# EAGLE design Kill Switch (EAGLE 5.02)
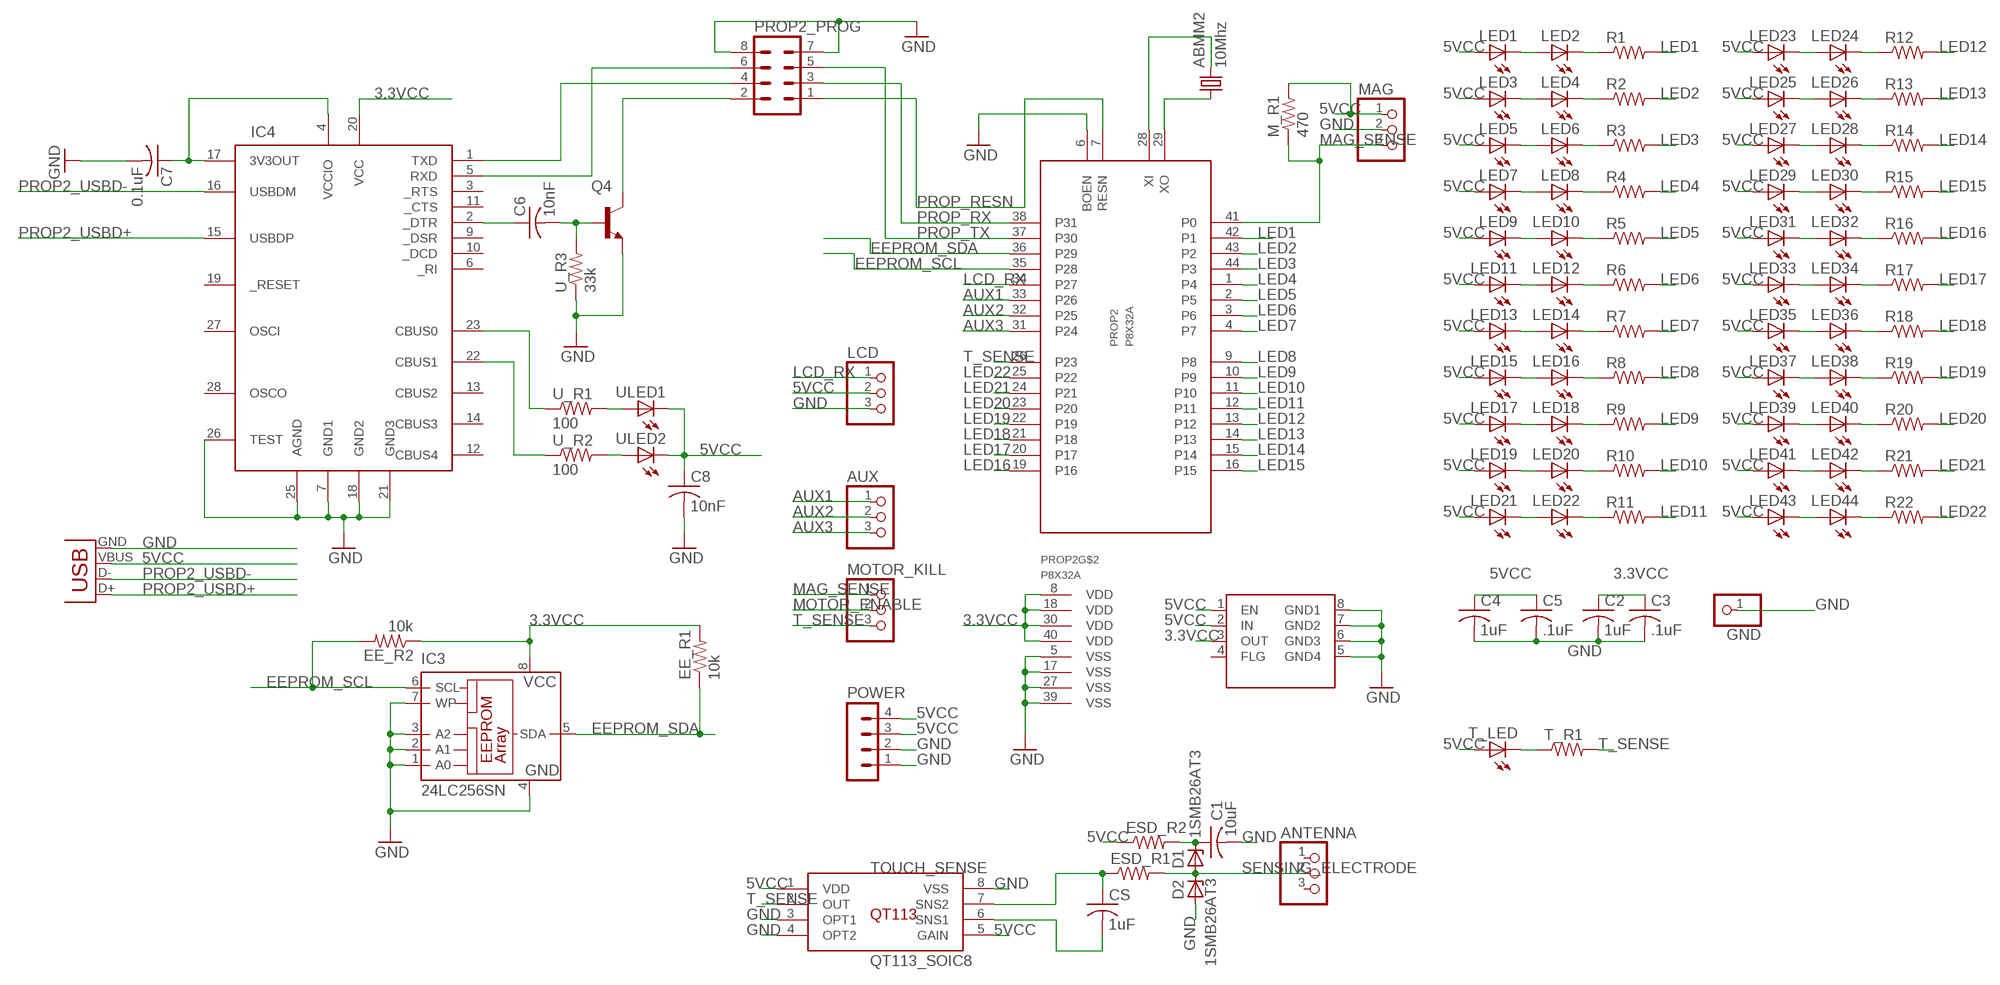
[diagram p0: schematic, sheet 1]

## Parts
3.3_VREG  TEST  [SOIC-8]
ABMM2  10Mhz  ABMM2  [ABMM2]
ANTENNA  PINHD-1X3  [1X03]
AUX  PINHD-1X3  [1X03]
C1  10uF  C-USC0402K  [C0402K]
C2  1uF  C-USC0402  [C0402]
C3  .1uF  C-USC0402  [C0402]
C4  1uF  C-USC0402  [C0402]
C5  .1uF  C-USC0402  [C0402]
C6  10nF  C-USC0402  [C0402]
C7  0.1uF  C-USC0402  [C0402]
C8  10nF  C-USC0402  [C0402]
CS  1uF  C-USC0402K  [C0402K]
D1  1SMB26AT3  TVS-SMB  [SMB@2]
D2  1SMB26AT3  TVS-SMB  [SMB@2]
EE_R1  10k  R-US_R0402  [R0402]
EE_R2  10k  R-US_R0402  [R0402]
ESD_R1  R-US_R0402  [R0402]
ESD_R2  R-US_R0402  [R0402]
GND  PINHD-1X1  [1X01]
IC3  24LC256SN  [SO-08]
IC4  FT232RL  [SSOP28DB]
LCD  PINHD-1X3  [1X03]
LED1  LEDCHIPLED_0805  [CHIPLED_0805]
LED2  LEDCHIPLED_0805  [CHIPLED_0805]
LED3  LEDCHIPLED_0805  [CHIPLED_0805]
LED4  LEDCHIPLED_0805  [CHIPLED_0805]
LED5  LEDCHIPLED_0805  [CHIPLED_0805]
LED6  LEDCHIPLED_0805  [CHIPLED_0805]
LED7  LEDCHIPLED_0805  [CHIPLED_0805]
LED8  LEDCHIPLED_0805  [CHIPLED_0805]
LED9  LEDCHIPLED_0805  [CHIPLED_0805]
LED10  LEDCHIPLED_0805  [CHIPLED_0805]
LED11  LEDCHIPLED_0805  [CHIPLED_0805]
LED12  LEDCHIPLED_0805  [CHIPLED_0805]
LED13  LEDCHIPLED_0805  [CHIPLED_0805]
LED14  LEDCHIPLED_0805  [CHIPLED_0805]
LED15  LEDCHIPLED_0805  [CHIPLED_0805]
LED16  LEDCHIPLED_0805  [CHIPLED_0805]
LED17  LEDCHIPLED_0805  [CHIPLED_0805]
LED18  LEDCHIPLED_0805  [CHIPLED_0805]
LED19  LEDCHIPLED_0805  [CHIPLED_0805]
LED20  LEDCHIPLED_0805  [CHIPLED_0805]
LED21  LEDCHIPLED_0805  [CHIPLED_0805]
LED22  LEDCHIPLED_0805  [CHIPLED_0805]
LED23  LEDCHIPLED_0805  [CHIPLED_0805]
LED24  LEDCHIPLED_0805  [CHIPLED_0805]
LED25  LEDCHIPLED_0805  [CHIPLED_0805]
LED26  LEDCHIPLED_0805  [CHIPLED_0805]
LED27  LEDCHIPLED_0805  [CHIPLED_0805]
LED28  LEDCHIPLED_0805  [CHIPLED_0805]
LED29  LEDCHIPLED_0805  [CHIPLED_0805]
LED30  LEDCHIPLED_0805  [CHIPLED_0805]
LED31  LEDCHIPLED_0805  [CHIPLED_0805]
LED32  LEDCHIPLED_0805  [CHIPLED_0805]
LED33  LEDCHIPLED_0805  [CHIPLED_0805]
LED34  LEDCHIPLED_0805  [CHIPLED_0805]
LED35  LEDCHIPLED_0805  [CHIPLED_0805]
LED36  LEDCHIPLED_0805  [CHIPLED_0805]
LED37  LEDCHIPLED_0805  [CHIPLED_0805]
LED38  LEDCHIPLED_0805  [CHIPLED_0805]
LED39  LEDCHIPLED_0805  [CHIPLED_0805]
LED40  LEDCHIPLED_0805  [CHIPLED_0805]
LED41  LEDCHIPLED_0805  [CHIPLED_0805]
LED42  LEDCHIPLED_0805  [CHIPLED_0805]
LED43  LEDCHIPLED_0805  [CHIPLED_0805]
LED44  LEDCHIPLED_0805  [CHIPLED_0805]
M_R1  470  R-US_R0402  [R0402]
MAG  PINHD-1X3  [1X03]
MOTOR_KILL  PINHD-1X3  [1X03]
POWER  MA04-1  [MA04-1]
PROP2  P8X32A  [LQFP-44]
PROP2_PROG  MA04-2  [MA04-2]
Q4  TRANSISTOR_NPNSOT23  [SOT23]
R1  R-US_R0402  [R0402]
R2  R-US_R0402  [R0402]
R3  R-US_R0402  [R0402]
R4  R-US_R0402  [R0402]
R5  R-US_R0402  [R0402]
R6  R-US_R0402  [R0402]
R7  R-US_R0402  [R0402]
R8  R-US_R0402  [R0402]
R9  R-US_R0402  [R0402]
R10  R-US_R0402  [R0402]
R11  R-US_R0402  [R0402]
R12  R-US_R0402  [R0402]
R13  R-US_R0402  [R0402]
R14  R-US_R0402  [R0402]
R15  R-US_R0402  [R0402]
R16  R-US_R0402  [R0402]
R17  R-US_R0402  [R0402]
R18  R-US_R0402  [R0402]
R19  R-US_R0402  [R0402]
R20  R-US_R0402  [R0402]
R21  R-US_R0402  [R0402]
R22  R-US_R0402  [R0402]
T_LED  LEDCHIPLED_0805  [CHIPLED_0805]
T_R1  R-US_R0402  [R0402]
TOUCH_SENSE  QT113_SOIC8  [SOIC8]
U_R1  100  R-US_R0402  [R0402]
U_R2  100  R-US_R0402  [R0402]
U_R3  33k  R-US_R0402  [R0402]
ULED1  LEDCHIPLED_0805  [CHIPLED_0805]
ULED2  LEDCHIPLED_0805  [CHIPLED_0805]
X2  USBMINIB  [USB-MINIB]

## Nets
3.3VCC: 3.3_VREG.3(OUT) C2.1 C3.1 EE_R1.2 EE_R2.1 IC3.8(VCC) IC4.20(VCC) PROP2.8(VDD) PROP2.18(VDD) PROP2.30(VDD) PROP2.40(VDD)
5VCC: 3.3_VREG.1(EN) 3.3_VREG.2(IN) C4.1 C5.1 C8.1 ESD_R2.1 LCD.2 LED1.A LED3.A LED5.A LED7.A LED9.A LED11.A LED13.A LED15.A LED17.A LED19.A LED21.A LED23.A LED25.A LED27.A LED29.A LED31.A LED33.A LED35.A LED37.A LED39.A LED41.A LED43.A M_R1.2 MAG.1 POWER.3 POWER.4 T_LED.A TOUCH_SENSE.1(VDD) TOUCH_SENSE.5(GAIN) ULED1.C ULED2.C X2.VBUS
AUX1: AUX.1 PROP2.33(P26)
AUX2: AUX.2 PROP2.32(P25)
AUX3: AUX.3 PROP2.31(P24)
EEPROM_SCL: EE_R2.2 IC3.6(SCL) PROP2.35(P28)
EEPROM_SDA: EE_R1.1 IC3.5(SDA) PROP2.36(P29)
GND: 3.3_VREG.5(GND4) 3.3_VREG.6(GND3) 3.3_VREG.7(GND2) 3.3_VREG.8(GND1) C1.2 C2.2 C3.2 C4.2 C5.2 C7.2 C8.2 D2.A GND.1 IC3.1(A0) IC3.2(A1) IC3.3(A2) IC3.4(GND) IC3.7(WP) IC4.7(GND1) IC4.18(GND2) IC4.21(GND3) IC4.25(AGND) IC4.26(TEST) LCD.3 MAG.2 POWER.1 POWER.2 PROP2.5(VSS) PROP2.6(BOEN) PROP2.17(VSS) PROP2.27(VSS) PROP2.39(VSS) PROP2_PROG.7 PROP2_PROG.8 Q4.2(E) TOUCH_SENSE.3(OPT1) TOUCH_SENSE.4(OPT2) TOUCH_SENSE.8(VSS) U_R3.1 X2.GND
LCD_RX: LCD.1 PROP2.34(P27)
LED1: PROP2.42(P1) R1.2
LED2: PROP2.43(P2) R2.2
LED3: PROP2.44(P3) R3.2
LED4: PROP2.1(P4) R4.2
LED5: PROP2.2(P5) R5.2
LED6: PROP2.3(P6) R6.2
LED7: PROP2.4(P7) R7.2
LED8: PROP2.9(P8) R8.2
LED9: PROP2.10(P9) R9.2
LED10: PROP2.11(P10) R10.2
LED11: PROP2.12(P11) R11.2
LED12: PROP2.13(P12) R12.2
LED13: PROP2.14(P13) R13.2
LED14: PROP2.15(P14) R14.2
LED15: PROP2.16(P15) R15.2
LED16: PROP2.19(P16) R16.2
LED17: PROP2.20(P17) R17.2
LED18: PROP2.21(P18) R18.2
LED19: PROP2.22(P19) R19.2
LED20: PROP2.23(P20) R20.2
LED21: PROP2.24(P21) R21.2
LED22: PROP2.25(P22) R22.2
LED24: LED24.C R12.1
LED26: LED26.C R13.1
LED28: LED28.C R14.1
LED35: LED35.C LED36.A
LED37: LED37.C LED38.A
LED44: LED44.C R22.1
MAG_SENSE: M_R1.1 MAG.3 MOTOR_KILL.1 PROP2.41(P0)
MOTOR_ENABLE: MOTOR_KILL.2
N$1: LED1.C LED2.A
N$2: LED2.C R1.1
N$3: LED3.C LED4.A
N$4: LED4.C R2.1
N$4_A: C6.2 Q4.1(B) U_R3.2
N$5: LED5.C LED6.A
N$5_A: C6.1 IC4.2(_DTR)
N$6: LED6.C R3.1
N$7: LED7.C LED8.A
N$7_A: IC4.23(CBUS0) U_R1.1
N$8: LED8.C R4.1
N$8_A: IC4.22(CBUS1) U_R2.1
N$9: LED9.C LED10.A
N$9_A: U_R1.2 ULED1.A
N$10: LED10.C R5.1
N$11: LED11.C LED12.A
N$12: LED12.C R6.1
N$13: LED13.C LED14.A
N$14: LED14.C R7.1
N$15: LED15.C LED16.A
N$16: LED16.C R8.1
N$17: LED17.C LED18.A
N$18: LED18.C R9.1
N$19: LED19.C LED20.A
N$20: LED20.C R10.1
N$21: T_LED.C T_R1.1
N$22: LED21.C LED22.A
N$23: LED22.C R11.1
N$24: LED23.C LED24.A
N$25: ABMM2.3 PROP2.28(XI)
N$26: ABMM2.1 PROP2.29(XO)
N$27: C1.1 D1.C ESD_R2.2
N$29: LED25.C LED26.A
N$31: CS.1 ESD_R1.1 TOUCH_SENSE.7(SNS2)
N$32: CS.2 TOUCH_SENSE.6(SNS1)
N$33: LED27.C LED28.A
N$35: LED29.C LED30.A
N$36: LED30.C R15.1
N$38: LED31.C LED32.A
N$39: LED32.C R16.1
N$40: LED33.C LED34.A
N$41: LED34.C R17.1
N$43: LED36.C R18.1
N$45: LED38.C R19.1
N$46: LED39.C LED40.A
N$47: LED40.C R20.1
N$48: LED41.C LED42.A
N$49: LED42.C R21.1
N$50: LED43.C LED44.A
N$51: U_R2.2 ULED2.A
PROP2_USBD+: IC4.15(USBDP) X2.D+
PROP2_USBD-: IC4.16(USBDM) X2.D-
PROP_3_3VOUT_A: C7.1 IC4.4(VCCIO) IC4.17(3V3OUT)
PROP_RESN: PROP2.7(RESN) PROP2_PROG.1
PROP_RESN_JMP_A: PROP2_PROG.2 Q4.3(C)
PROP_RX: PROP2.38(P31) PROP2_PROG.3
PROP_RX_JMP_A: IC4.1(TXD) PROP2_PROG.4
PROP_TX: PROP2.37(P30) PROP2_PROG.5
PROP_TX_JMP_A: IC4.5(RXD) PROP2_PROG.6
SENSING_ELECTRODE: ANTENNA.2 D1.A D2.C ESD_R1.2
T_SENSE: MOTOR_KILL.3 PROP2.26(P23) T_R1.2 TOUCH_SENSE.2(OUT)
Unconnected: 3.3_VREG.4(FLG) ANTENNA.1 ANTENNA.3 IC4.3(_RTS) IC4.6(_RI) IC4.9(_DSR) IC4.10(_DCD) IC4.11(_CTS) IC4.12(CBUS4) IC4.13(CBUS2) IC4.14(CBUS3) IC4.19(_RESET) IC4.27(OSCI) IC4.28(OSCO)

## Library data of the parts
3.3_VREG = micrel2:TEST
ABMM2 = crystal-abracon:ABMM2
ANTENNA AUX LCD MAG MOTOR_KILL = pinhead:PINHD-1X3: PIN HEADER
C1 CS = resistor:C-US: CAPACITOR, American symbol
C2-C8 = rcl:C-US: CAPACITOR, American symbol
D1 D2 = diode:TVS-?
EE_R1 EE_R2 M_R1 = resistor:R-US_: RESISTOR, American symbol
ESD_R1 ESD_R2 R1-R22 T_R1 U_R1-U_R3 = rcl:R-US_: RESISTOR, American symbol
GND = pinhead:PINHD-1X1: PIN HEADER
IC3 = microchip:24*: Serial EEPROM I2C
IC4 = SparkFunEagle-6-6-07:FT232RL: USB UART FT232RL 4th Generation USB UART (USB <-> Serial) Controller. Spark Fun Electronics SKU : COM-00650
LED1-LED44 T_LED ULED1 ULED2 = led:LED: LED OSRAM: - CHIPLED LG R971, LG N971, LY N971, LG Q971, LY Q971, LO R971, LY R971 LH N974, LH R974 LS Q976, LO Q976, LY Q976 LO Q996 - Hyper CHIPLED LW Q18S LB Q993, LB Q99A, LB R99A - SideLED LS A670, LO A670, LY A670, LG A670, LP A670 LB A673, LV A673, LT A673, LW A673 LH A674 LY A675 LS A676, LA A676, LO A676, LY A676, LW A676 LS A679, LY A679, LG A679 - Hyper Micro SIDELED® LS Y876, LA Y876, LO Y876, LY Y876 LT Y87S - SmartLED LW L88C, LW L88S LB L89C, LB L89S, LG L890 LS L89K, LO L89K, LY L89K LS L896, LA L896, LO L896, LY L896 - TOPLED LS T670, LO T670, LY T670, LG T670, LP T670 LSG T670, LSP T670, LSY T670, LOP T670, LYG T670 LG T671, LOG T671, LSG T671 LB T673, LV T673, LT T673, LW T673 LH T674 LS T676, LA T676, LO T676, LY T676, LB T676, LH T676, LSB T676, LW T676 LB T67C, LV T67C, LT T67C, LS T67K, LO T67K, LY T67K, LW E67C LS E67B, LA E67B, LO E67B, LY E67B, LB E67C, LV E67C, LT E67C LW T67C LS T679, LY T679, LG T679 LS T770, LO T770, LY T770, LG T770, LP T770 LB T773, LV T773, LT T773, LW T773 LH T774 LS E675, LA E675, LY E675, LS T675 LS T776, LA T776, LO T776, LY T776, LB T776 LHGB T686 LT T68C, LB T68C - Hyper Mini TOPLED® LB M676 - Mini TOPLED Santana® LG M470 LS M47K, LO M47K, LY M47K Source: http://www.osram.convergy.de - LUMILED® LXK2-PW12-R00, LXK2-PW12-S00, LXK2-PW14-U00, LXK2-PW14-V00 LXK2-PM12-R00, LXK2-PM12-S00, LXK2-PM14-U00 LXK2-PE12-Q00, LXK2-PE12-R00, LXK2-PE12-S00, LXK2-PE14-T00, LXK2-PE14-U00 LXK2-PB12-K00, LXK2-PB12-L00, LXK2-PB12-M00, LXK2-PB14-N00, LXK2-PB14-P00, LXK2-PB14-Q00 LXK2-PR12-L00, LXK2-PR12-M00, LXK2-PR14-Q00, LXK2-PR14-R00 LXK2-PD12-Q00, LXK2-PD12-R00, LXK2-PD12-S00 LXK2-PH12-R00, LXK2-PH12-S00 LXK2-PL12-P00, LXK2-PL12-Q00, LXK2-PL12-R00 Source: www.luxeon.com
POWER = con-lstb:MA04-1: PIN HEADER
PROP2 = propeller:P8X32A
PROP2_PROG = con-lstb:MA04-2: PIN HEADER
Q4 = SparkFunEagle-6-6-07:TRANSISTOR_NPN: Transistor NPN BJT configuration in SOT23 package. MMBT2222 is the common NPN we use. Double check BCE configuration again layout.
TOUCH_SENSE = QT113:QT113_SOIC8
X2 = SparkFunEagle-6-6-07:USB: USB Connectors USB-B-PTH is fully proven SKU : PRT-00139 USB-miniB is fully proven SKU : PRT-00587 USB-A-H is throughly reviewed, but untested. Spark Fun Electronics SKU : PRT-00437 USB-B-SMT is throughly reviewed, but untested. Needs silkscreen touching up. USB-A-S has not been used/tested USB-MB-H has not been used/tested

## Board
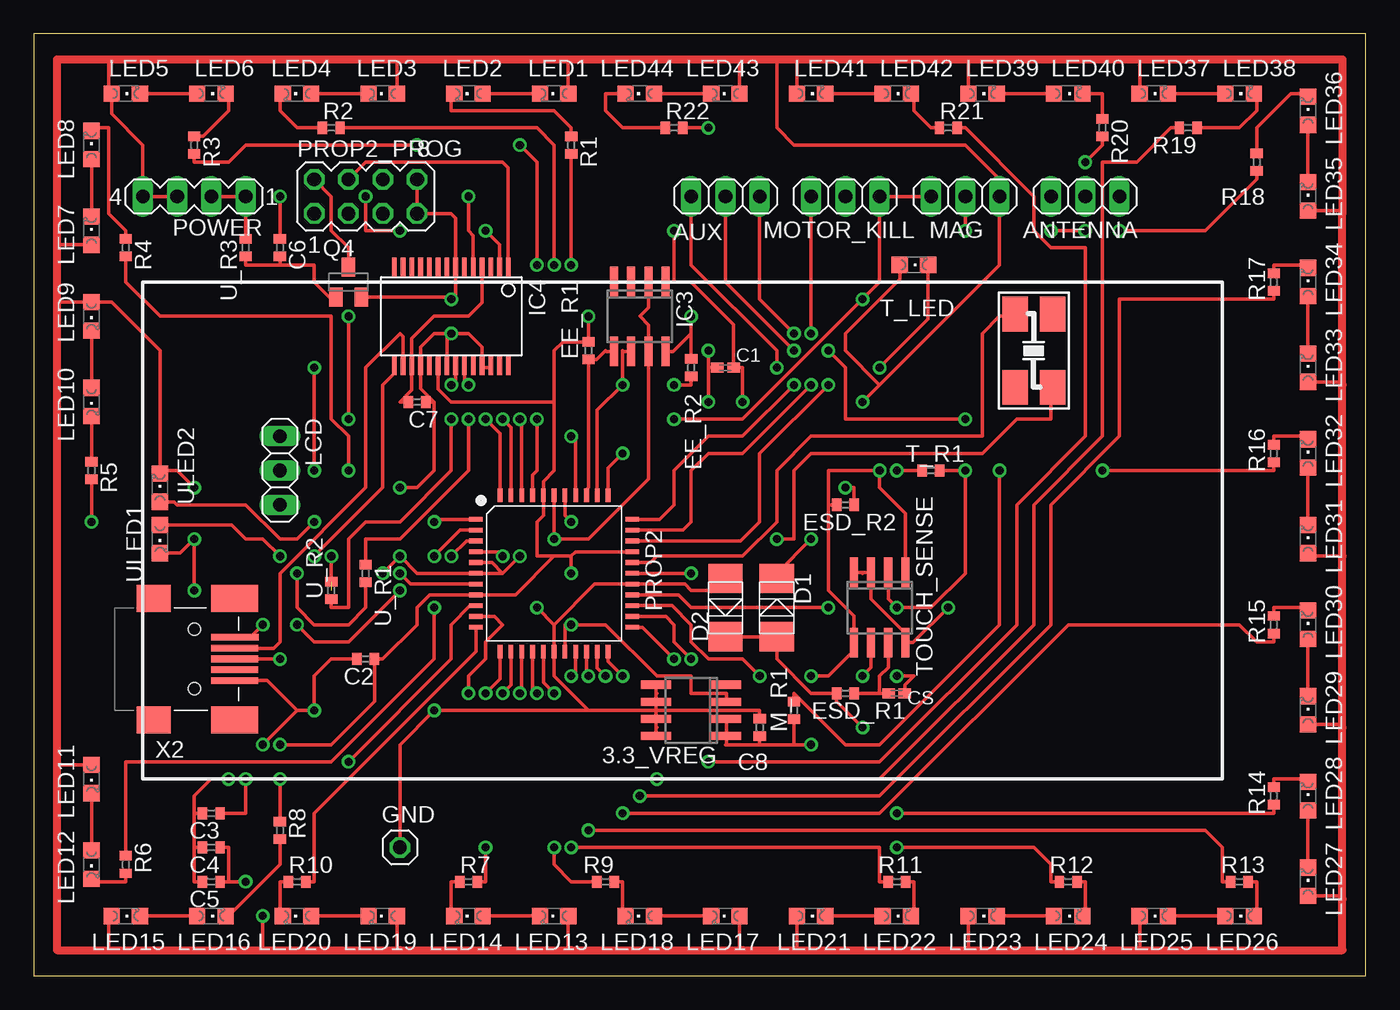
[diagram p1: board, top side]
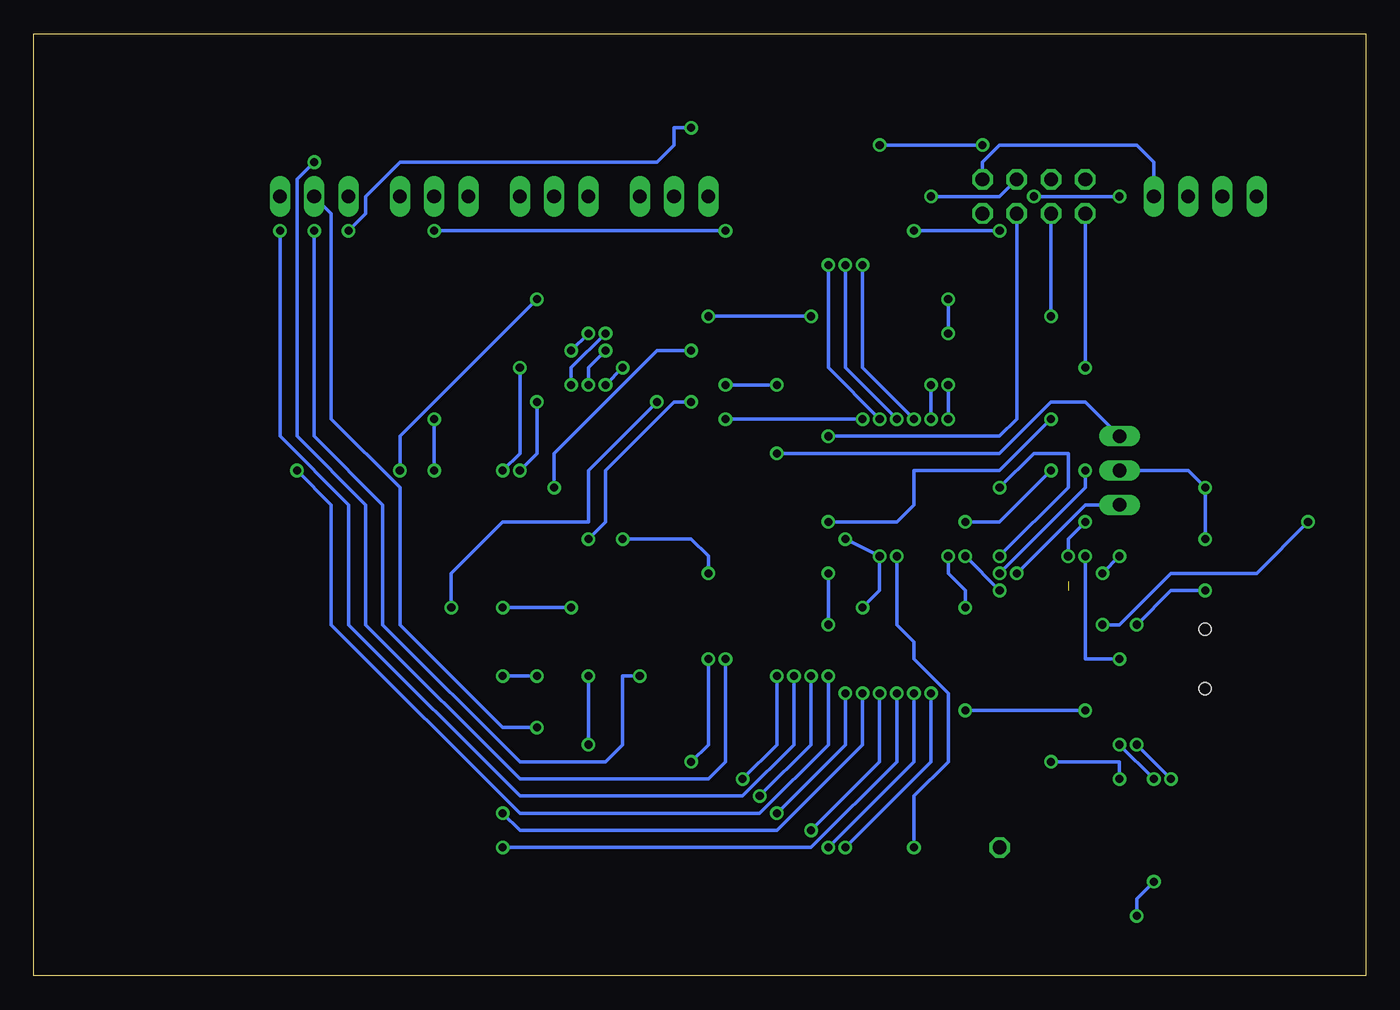
[diagram p2: board, bottom side, seen from below]

Size 98.73 x 69.84 mm. Coordinates in mm from the lower left corner, seen from the top.
Outline: 0,0 98.73,0 98.73,69.84 0,69.84 0,0
Copper layers (1*16): Top 0.035mm / dielectric 1.5mm / Bottom 0.035mm
Design rules "default *": minimum track width 10mil, minimum drill 15mil, track to track 8mil, track to pad 8mil, pad to pad 8mil, via to via 8mil, smd to smd 8mil, copper to edge 40mil, drill to drill 8mil, minimum pad ring 10mil, minimum via ring 8mil, stop-mask expansion 4mil, vias tented up to drill 0mil, thermal gap 10mil

### Footprints (pad centres in the part's own frame; a part is rotated, then mirrored left to right if it is on the bottom)
SOIC-8 = smd 0.6 x 2.2: 1 -1.905,-2.6; 2 -0.635,-2.6; 3 0.635,-2.6; 4 1.905,-2.6; 5 1.905,2.6; 6 0.635,2.6; 7 -0.635,2.6; 8 -1.905,2.6
ABMM2 = smd 2.575 x 1.9: 1 -2.712,-1.4; 2 2.712,-1.4; 3 2.712,1.4; 4 -2.712,1.4
1X03 = drill 1.016 long: 1 -2.54,0; 2 0,0; 3 2.54,0
C0402K = smd 0.925 x 0.74: 1 -0.6,0; 2 0.6,0
C0402 = smd 0.7 x 0.9: 1 -0.65,0; 2 0.65,0
SMB@2 = smd 2.159 x 2.54: A 2.159,0; C -2.159,0
R0402 = smd 0.7 x 0.9: 1 -0.65,0; 2 0.65,0
1X01 = drill 1.016 octagon: 1 0,0
SO-08 = smd 0.6 x 2.2: 1 -1.905,-2.6; 2 -0.635,-2.6; 3 0.635,-2.6; 4 1.905,-2.6; 5 1.905,2.6; 6 0.635,2.6; 7 -0.635,2.6; 8 -1.905,2.6
SSOP28DB = smd 0.348 x 1.397: 1 -4.225,-3.656; 2 -3.575,-3.656; 3 -2.925,-3.656; 4 -2.275,-3.656; 5 -1.625,-3.656; 6 -0.975,-3.656; 7 -0.325,-3.656; 8 0.325,-3.656; 9 0.975,-3.656; 10 1.625,-3.656; 11 2.275,-3.656; 12 2.925,-3.656; 13 3.575,-3.656; 14 4.225,-3.656; 15 4.225,3.656; 16 3.575,3.656; 17 2.925,3.656; 18 2.275,3.656; 19 1.625,3.656; 20 0.975,3.656; 21 0.325,3.656; 22 -0.325,3.656; 23 -0.975,3.656; 24 -1.625,3.656; 25 -2.275,3.656; 26 -2.925,3.656; 27 -3.575,3.656; 28 -4.225,3.656
CHIPLED_0805 = smd 1.2 x 1.2: A 0,-1.05; C 0,1.05
MA04-1 = drill 1.016 long: 1 -3.81,0; 2 -1.27,0; 3 1.27,0; 4 3.81,0
LQFP-44 = smd 0.35 x 1: 1 -4,-5.8; 2 -3.2,-5.8; 3 -2.4,-5.8; 4 -1.6,-5.8; 5 -0.8,-5.8; 6 0,-5.8; 7 0.8,-5.8; 8 1.6,-5.8; 9 2.4,-5.8; 10 3.2,-5.8; 11 4,-5.8; 23 4,5.8; 24 3.2,5.8; 25 2.4,5.8; 26 1.6,5.8; 27 0.8,5.8; 28 0,5.8; 29 -0.8,5.8; 30 -1.6,5.8; 31 -2.4,5.8; 32 -3.2,5.8; 33 -4,5.8 | smd 1 x 0.35: 12 5.8,-4; 13 5.8,-3.2; 14 5.8,-2.4; 15 5.8,-1.6; 16 5.8,-0.8; 17 5.8,0; 18 5.8,0.8; 19 5.8,1.6; 20 5.8,2.4; 21 5.8,3.2; 22 5.8,4; 34 -5.8,4; 35 -5.8,3.2; 36 -5.8,2.4; 37 -5.8,1.6; 38 -5.8,0.8; 39 -5.8,0; 40 -5.8,-0.8; 41 -5.8,-1.6; 42 -5.8,-2.4; 43 -5.8,-3.2; 44 -5.8,-4
MA04-2 = drill 1.016 octagon: 1 -3.81,-1.27; 2 -3.81,1.27; 3 -1.27,-1.27; 4 -1.27,1.27; 5 1.27,-1.27; 6 1.27,1.27; 7 3.81,-1.27; 8 3.81,1.27
SOT23 = smd 1 x 1.4: 1 -0.95,-1.1; 2 0.95,-1.1; 3 0,1.1
SOIC8 = smd 0.6 x 2.2: 1 -1.905,-2.6; 2 -0.635,-2.6; 3 0.635,-2.6; 4 1.905,-2.6; 5 1.905,2.6; 6 0.635,2.6; 7 -0.635,2.6; 8 -1.905,2.6
USB-MINIB = smd 2.5 x 2: 1 -3,-4.5; 2 -3,4.5 | smd 3.5 x 2: 3 3,-4.5; 4 3,4.5 | smd 3.5 x 0.5: D+ 3,0; D- 3,0.8; GND 3,-1.6; ID 3,-0.8; VBUS 3.01,1.61 | hole 0.9: 0,2.2; 0,-2.2

### Placement (x,y rotation side)
3.3_VREG  48.73,19.68 90 top
ABMM2  74.13,46.35 270 top
ANTENNA  77.94,57.78 180 top
AUX  51.27,57.78 0 top
C1  51.27,45.08 0 top
C2  24.6,23.49 180 top
C3  13.17,12.06 180 top
C4  13.17,9.52 180 top
C5  13.17,6.98 180 top
C6  18.25,53.97 270 top
C7  28.41,42.54 0 top
C8  53.81,18.41 90 top
CS  63.97,20.95 0 top
D1  55.08,27.3 270 top
D2  51.27,27.3 90 top
EE_R1  41.11,46.35 90 top
EE_R2  48.73,45.08 270 top
ESD_R1  60.16,20.95 180 top
ESD_R2  60.16,34.92 0 top
GND  27.14,9.52 0 top
IC3  44.92,48.89 180 top
IC4  30.95,48.89 180 top
LCD  18.25,37.46 270 top
LED1  38.57,65.4 90 top
LED2  32.22,65.4 90 top
LED3  25.87,65.4 90 top
LED4  19.52,65.4 90 top
LED5  6.82,65.4 270 top
LED6  13.17,65.4 270 top
LED7  4.28,55.24 0 top
LED8  4.28,61.59 0 top
LED9  4.28,48.89 180 top
LED10  4.28,42.54 180 top
LED11  4.28,14.6 180 top
LED12  4.28,8.25 180 top
LED13  38.57,4.44 90 top
LED14  32.22,4.44 90 top
LED15  6.82,4.44 270 top
LED16  13.17,4.44 270 top
LED17  51.27,4.44 90 top
LED18  44.92,4.44 90 top
LED19  25.87,4.44 90 top
LED20  19.52,4.44 90 top
LED21  57.62,4.44 270 top
LED22  63.97,4.44 270 top
LED23  70.32,4.44 270 top
LED24  76.67,4.44 270 top
LED25  83.02,4.44 270 top
LED26  89.37,4.44 270 top
LED27  94.45,6.98 0 top
LED28  94.45,13.33 0 top
LED29  94.45,19.68 0 top
LED30  94.45,26.03 0 top
LED31  94.45,32.38 0 top
LED32  94.45,38.73 0 top
LED33  94.45,45.08 0 top
LED34  94.45,51.43 0 top
LED35  94.45,57.78 0 top
LED36  94.45,64.13 0 top
LED37  83.02,65.4 270 top
LED38  89.37,65.4 270 top
LED39  70.32,65.4 270 top
LED40  76.67,65.4 270 top
LED41  57.62,65.4 270 top
LED42  63.97,65.4 270 top
LED43  51.27,65.4 90 top
LED44  44.92,65.4 90 top
M_R1  56.35,19.68 270 top
MAG  69.05,57.78 180 top
MOTOR_KILL  60.16,57.78 180 top
POWER  11.9,57.78 180 top
PROP2  38.57,29.84 270 top
PROP2_PROG  24.6,57.78 0 top
Q4  23.33,51.43 0 top
R1  39.84,61.59 270 top
R2  22.06,62.86 0 top
R3  11.9,61.59 270 top
R4  6.82,53.97 270 top
R5  4.28,37.46 270 top
R6  6.82,8.25 90 top
R7  32.22,6.98 0 top
R8  18.25,10.79 90 top
R9  42.38,6.98 180 top
R10  19.52,6.98 0 top
R11  63.97,6.98 180 top
R12  76.67,6.98 180 top
R13  89.37,6.98 180 top
R14  91.91,13.33 270 top
R15  91.91,26.03 270 top
R16  91.91,38.73 270 top
R17  91.91,51.43 270 top
R18  90.64,60.32 270 top
R19  85.56,62.86 180 top
R20  79.21,62.86 270 top
R21  67.78,62.86 0 top
R22  47.46,62.86 0 top
T_LED  65.24,52.7 270 top
T_R1  66.51,37.46 0 top
TOUCH_SENSE  62.7,27.3 180 top
U_R1  24.6,29.84 270 top
U_R2  22.06,28.57 90 top
U_R3  15.71,53.97 270 top
ULED1  9.36,32.38 180 top
ULED2  9.36,36.19 0 top
X2  11.9,23.49 0 top

### Tracks (layer width: path | path; a pad name or v marks a point on that pad's centre or on a via)
3.3VCC  (via drill 0.6)
  Top 0.254: 38.57,31.11 39.84,31.11 | 38.57,31.11 35.7,28.24 PROP2.8 29.35,28.24 28.41,27.3 28.41,26.03 25.87,23.49 C2.1 25.25,20.33 22.06,17.14 v18.25,17.14 | PROP2.18 39.37,26.03 v39.84,26.03 42.38,26.03 46.19,22.22 48.73,22.22 48.73,20.95 51.33,20.95 3.3_VREG.3 | 39.84,31.11 v39.84,29.84 | v41.11,48.89 EE_R1.2 39.22,47 38.57,46.35 38.57,42.54 | 48.73,47.62 EE_R2.1 | v48.73,48.89 48.73,47.62 | IC3.8 47.4,46.29 48.73,47.62 | IC4.20 29.97,43.52 30.95,42.54 38.57,42.54 | PROP2.30 40.17,31.44 39.84,31.11 | 38.57,31.11 37.3,31.11 37.3,33.65 37.77,34.12 PROP2.40 37.77,36.66 38.57,37.46 38.57,42.54 | v15.71,14.6 15.71,12.06 C3.1
  Bottom 0.254: v39.84,29.84 v39.84,26.03 | v41.11,48.89 v48.73,48.89 | v15.71,14.6 v18.25,17.14
5VCC  (via drill 0.6)
  Top 0.254: 53.81,17.14 C8.1 | 53.81,17.14 51.33,17.14 | 51.33,17.14 3.3_VREG.1 | 51.33,17.14 51.27,17.14 51.33,17.2 3.3_VREG.2 | POWER.3 POWER.4 8.09,61.59 5.77,63.91 LED5.A 5.55,65.4 5.55,67.94 | 58.89,34.92 58.89,37.46 v62.7,37.46 | 58.89,34.92 ESD_R2.1 | 62.7,43.81 v61.43,42.54 | 62.7,43.81 71.59,52.7 MAG.1 71.59,59.05 69.05,61.59 56.35,61.59 55.08,62.86 55.08,67.94 | v62.7,37.46 62.92,37.24 | ULED1.C 10.85,31.33 v11.9,32.38 v11.9,28.57 | v11.9,36.19 10.63,37.46 9.36,37.46 | T_LED.A 64.19,51.65 60.16,47.62 60.16,46.35 62.7,43.81 | v62.7,37.46 62.7,36.19 64.61,34.28 TOUCH_SENSE.1 | 9.36,37.46 ULED2.C | 9.36,37.46 9.36,46.35 5.77,49.94 LED9.A 1.96,49.94 1.74,50.16 | LED15.A 5.55,4.44 5.55,1.9 | LED41.A 56.57,67.72 56.35,67.94 | LED3.A 26.92,67.72 27.14,67.94 | LED1.A 39.62,67.72 39.84,67.94 | LED43.A 52.32,67.72 52.54,67.94 | LED39.A 69.27,67.72 69.05,67.94 | LED37.A 81.97,67.72 81.75,67.94 | LED23.A 69.27,2.12 69.05,1.9 | LED25.A 81.97,2.12 81.75,1.9 | LED35.A 96.77,56.73 96.99,56.51 | LED33.A 96.77,44.03 96.99,43.81 | LED31.A 94.45,31.11 96.99,31.11 | LED29.A 96.77,18.63 96.99,18.41 | LED27.A 96.77,5.93 96.99,5.71 | LED21.A 56.57,2.12 56.35,1.9 | LED17.A 52.32,2.12 52.54,1.9 | LED13.A 39.62,2.12 39.84,1.9 | LED19.A 26.92,2.12 27.14,1.9 | LED11.A 1.96,15.65 1.74,15.87 | LED7.A 1.96,54.19 1.74,53.97 | v57.62,17.14 56.35,17.14 | 56.35,17.14 53.81,17.14 | 56.35,17.14 M_R1.2 | X2.VBUS 16.05,25.1 v16.98,26.03 | v57.62,22.22 58.89,22.22 60.8,24.12 TOUCH_SENSE.5 60.8,26.66 58.89,28.57 58.89,34.92 | 14.44,6.98 C5.1 | 14.44,6.98 14.44,9.52 C4.1 | 1.74,1.9 16.98,1.9 v16.98,4.44 | v15.71,6.98 14.44,6.98
  Top 0.61: 1.74,1.9 1.74,15.87 1.74,50.16 1.74,53.97 1.74,67.94 5.55,67.94 27.14,67.94 39.84,67.94 52.54,67.94 55.08,67.94 56.35,67.94 69.05,67.94 81.75,67.94 96.99,67.94 96.99,56.51 96.99,43.81 96.99,31.11 96.99,18.41 96.99,5.71 96.99,1.9 81.75,1.9 69.05,1.9 56.35,1.9 52.54,1.9 39.84,1.9 27.14,1.9 5.55,1.9 1.74,1.9
  Bottom 0.254: v57.62,22.22 v57.62,17.14 | v61.43,42.54 61.43,38.73 v62.7,37.46 | v11.9,32.38 v11.9,36.19 13.17,37.46 LCD.2 | v16.98,26.03 14.44,28.57 v11.9,28.57 | v16.98,4.44 16.98,5.71 v15.71,6.98
AUX1  (via drill 0.6)
  Top 0.254: PROP2.33 46.38,33.84 47.46,34.92 47.46,37.46 50,40 52.54,40 v56.35,43.81 | v55.08,45.08 55.08,46.35 48.73,52.7 AUX.1
  Bottom 0.254: v56.35,43.81 v55.08,45.08
AUX2  (via drill 0.6)
  Top 0.254: PROP2.32 48.12,33.04 48.73,33.65 48.73,37.46 50,38.73 52.54,38.73 v57.62,43.81 | v56.35,46.35 51.27,51.43 AUX.2
  Bottom 0.254: v57.62,43.81 57.62,45.08 v56.35,46.35
AUX3  (via drill 0.6)
  Top 0.254: PROP2.31 52.4,32.24 53.81,33.65 53.81,38.73 v58.89,43.81 | v56.35,47.62 53.81,50.16 AUX.3
  Bottom 0.254: v58.89,43.81 58.89,45.08 v56.35,47.62
EEPROM_SCL  (via drill 0.6)
  Top 0.254: IC3.6 43.71,46.29 43.65,46.35 v43.65,43.81 41.77,41.93 PROP2.35 | v47.46,43.81 48.73,43.81 EE_R2.2
  Bottom 0.254: v43.65,43.81 v47.46,43.81
EEPROM_SDA
  Top 0.254: IC3.5 42.44,46.29 42.38,46.35 41.73,45.7 EE_R1.1 41.11,36.19 40.97,36.05 PROP2.36
GND  (via drill 0.6)
  Top 0.254: PROP2_PROG.8 PROP2_PROG.7 30.95,56.51 31.28,56.19 IC4.7 31.28,50.48 v30.95,50.16 30.78,50.33 Q4.2 | 38.57,26.03 41.58,29.04 PROP2.27 48.26,29.04 48.73,28.57 50,28.57 51.27,29.84 D2.A | 38.57,26.03 PROP2.17 38.57,22.22 41.11,19.68 | 46.13,18.41 3.3_VREG.7 46.13,19.68 | 46.13,18.41 3.3_VREG.8 | 46.13,18.41 46.19,18.41 | 46.13,19.68 3.3_VREG.6 46.13,20.95 | 46.13,20.95 3.3_VREG.5 46.13,18.41 | 46.13,20.95 46.19,20.95 | 46.19,19.68 53.81,19.68 C8.2 | 46.19,19.68 46.13,19.68 | 34.76,29.84 PROP2.6 | 38.57,26.03 v37.3,27.3 | PROP2.5 33.96,30.64 34.76,29.84 | IC3.4 43.02,51.43 44.29,51.43 | 44.29,51.43 IC3.3 | 45.55,51.43 44.29,51.43 | 45.55,51.43 IC3.2 | IC3.1 46.83,51.43 46.19,51.43 | 45.55,51.43 46.19,51.43 | v52.54,42.54 52.54,45.08 C1.2 51.87,48.29 48.73,51.43 47.46,51.43 | 29.68,42.54 28.68,43.55 IC4.18 28.68,46.62 29.68,47.62 v30.95,47.62 | 29.68,42.54 C7.2 | IC4.25 33.23,45.34 | 30.62,45.41 IC4.21 30.62,47.3 v30.95,47.62 | POWER.2 POWER.1 U_R3.1 | 46.19,51.43 47.46,51.43 | IC4.25 33.23,45.08 33.88,45.08 IC4.26 | v38.57,32.38 41.11,32.38 45.55,36.83 IC3.7 45.55,48.26 44.92,48.89 45.55,49.52 45.55,51.43 | v38.57,32.38 PROP2.39 v38.57,32.38 | 41.11,19.68 46.19,19.68 | v69.05,55.24 MAG.2 | 47.46,51.43 v47.46,55.24 | IC4.25 33.23,46.62 32.22,47.62 v30.95,47.62 | v36.03,31.11 34.76,29.84 | 34.76,29.84 28.41,29.84 v27.14,31.11 v25.87,29.84 | v27.14,36.19 28.41,36.19 29.68,37.46 29.68,42.54 | 19.52,19.68 v20.79,19.68 20.79,22.22 22.06,23.49 C2.2 | 41.11,19.68 v29.68,19.68 27.14,17.14 GND.1 | X2.GND 17.31,21.89 19.52,19.68 | v67.78,27.3 65.18,24.7 TOUCH_SENSE.8 64.61,25.39 62.07,27.93 TOUCH_SENSE.3 61.49,29.9 61.43,29.84 61.37,29.9 TOUCH_SENSE.4
  Top 0.254: C5.2 11.9,6.98 11.9,9.52 | 11.9,9.52 C4.2 | 11.9,9.52 11.9,12.06 | 11.9,12.06 C3.2 | v16.98,17.14 19.52,19.68 | v14.44,14.6 13.17,14.6 11.9,13.33 11.9,12.06
  Bottom 0.254: v38.57,32.38 v36.03,31.11 36.03,28.57 v37.3,27.3 | v47.46,55.24 v69.05,55.24 | v30.95,47.62 v30.95,50.16 | PROP2_PROG.8 28.41,60.32 27.14,61.59 16.98,61.59 15.71,60.32 POWER.1 | v27.14,36.19 24.6,38.73 22.06,38.73 22.06,36.19 v27.14,31.11 | v20.79,19.68 v29.68,19.68 | LCD.3 20.79,34.92 v25.87,29.84 | v52.54,42.54 57.62,37.46 57.62,33.65 63.97,33.65 67.78,29.84 v67.78,27.3 | v14.44,14.6 v16.98,17.14
LCD_RX  (via drill 0.6)
  Top 0.254: PROP2.34 42.57,37.65 v43.65,38.73
  Bottom 0.254: v43.65,38.73 27.14,38.73 23.33,42.54 20.79,42.54 LCD.1
LED1  (via drill 0.6)
  Top 0.254: PROP2.42 36.17,41.13 v36.03,41.27 | v39.84,52.7 R1.2
  Bottom 0.254: v36.03,41.27 39.84,45.08 v39.84,52.7
LED2  (via drill 0.6)
  Top 0.254: PROP2.43 35.37,40.66 v34.76,41.27 | v38.57,52.7 38.57,61.59 37.3,62.86 R2.2
  Bottom 0.254: v34.76,41.27 38.57,45.08 v38.57,52.7
LED3  (via drill 0.6)
  Top 0.254: PROP2.44 34.57,40.19 v33.49,41.27 | v37.3,52.7 37.3,60.32 v36.03,61.59 | v28.41,61.59 15.71,61.59 14.44,60.32 11.9,60.32 R3.2
  Bottom 0.254: v33.49,41.27 37.3,45.08 v37.3,52.7 | v36.03,61.59 v28.41,61.59
LED4  (via drill 0.6)
  Top 0.254: PROP2.1 29.87,33.84 v29.68,33.65 | v23.33,37.46 23.33,40 22.06,41.27 22.06,48.89 9.36,48.89 6.82,51.43 R4.2
  Bottom 0.254: v29.68,33.65 27.14,33.65 v23.33,37.46
LED5  (via drill 0.6)
  Top 0.254: PROP2.2 31.61,33.04 v29.68,31.11 | v4.28,33.65 R5.2 | v19.52,26.03 20.79,24.76 23.33,24.76 v27.14,28.57
  Bottom 0.254: v27.14,28.57 v29.68,31.11 | v19.52,26.03 18.25,26.03 14.44,29.84 8.09,29.84 v4.28,33.65
LED6  (via drill 0.6)
  Top 0.254: PROP2.3 32.08,32.24 v30.95,31.11 | v29.68,27.3 29.68,23.49 22.06,15.87 6.82,15.87 R6.2
  Bottom 0.254: v30.95,31.11 30.95,29.84 29.68,28.57 v29.68,27.3
LED7  (via drill 0.6)
  Top 0.254: PROP2.4 34.43,31.44 v34.76,31.11 | v33.49,9.52 33.49,6.98 R7.2
  Bottom 0.254: v34.76,31.11 34.76,26.03 33.49,24.76 33.49,23.49 30.95,20.95 30.95,15.87 33.49,13.33 v33.49,9.52
LED8  (via drill 0.6)
  Top 0.254: PROP2.9 32.36,27.44 30.95,26.03 30.95,23.49 v23.33,15.87 | R8.2 v18.25,14.6
  Bottom 0.254: v23.33,15.87 18.25,15.87 v18.25,14.6
LED9  (via drill 0.6)
  Top 0.254: PROP2.10 34.15,26.64 34.76,26.03 33.49,24.76 33.49,23.49 32.22,22.22 v32.22,20.95 | v38.57,9.52 38.57,8.25 39.84,6.98 R9.2
  Bottom 0.254: v32.22,20.95 32.22,15.87 v38.57,9.52
LED10
  Top 0.254: PROP2.11 32.77,24.04 20.79,12.06 20.79,6.98 R10.2
LED11  (via drill 0.6)
  Top 0.254: PROP2.12 34.57,22.03 v33.49,20.95 | v39.84,9.52 62.7,9.52 62.7,6.98 R11.2
  Bottom 0.254: v33.49,20.95 33.49,15.87 v39.84,9.52
LED12  (via drill 0.6)
  Top 0.254: PROP2.13 35.37,21.56 v34.76,20.95 | v63.97,9.52 74.13,9.52 75.4,8.25 75.4,6.98 R12.2
  Bottom 0.254: v34.76,20.95 34.76,15.87 41.11,9.52 v63.97,9.52
LED13  (via drill 0.6)
  Top 0.254: PROP2.14 36.17,21.09 v36.03,20.95 | v41.11,10.79 86.83,10.79 88.1,9.52 88.1,6.98 R13.2
  Bottom 0.254: v36.03,20.95 36.03,15.87 v41.11,10.79
LED14  (via drill 0.6)
  Top 0.254: PROP2.15 36.97,21.28 v37.3,20.95 | v63.97,12.06 91.91,12.06 R14.2
  Bottom 0.254: v37.3,20.95 37.3,17.14 43.65,10.79 62.7,10.79 v63.97,12.06
LED15  (via drill 0.6)
  Top 0.254: PROP2.16 37.77,21.75 v38.57,20.95 | v43.65,12.06 62.7,12.06 76.67,26.03 89.37,26.03 90.64,24.76 91.91,24.76 R15.2
  Bottom 0.254: v38.57,20.95 38.57,17.14 v43.65,12.06
LED16  (via drill 0.6)
  Top 0.254: PROP2.19 40.17,22.55 v39.84,22.22 | R16.2 91.91,37.46 v79.21,37.46
  Bottom 0.254: v39.84,22.22 39.84,17.14 44.92,12.06 62.7,12.06 76.67,26.03 76.67,34.92 v79.21,37.46
LED17  (via drill 0.6)
  Top 0.254: PROP2.20 40.97,22.36 v41.11,22.22 | v44.92,13.33 62.7,13.33 75.4,26.03 75.4,34.92 80.48,40 80.48,50.16 91.91,50.16 R17.2
  Bottom 0.254: v41.11,22.22 41.11,17.14 v44.92,13.33
LED18  (via drill 0.6)
  Top 0.254: PROP2.21 41.77,22.83 v42.38,22.22 | v80.48,55.24 86.83,55.24 90.64,59.05 R18.2
  Bottom 0.254: v42.38,22.22 42.38,17.14 46.19,13.33 62.7,13.33 75.4,26.03 75.4,34.92 80.48,40 v80.48,55.24
LED19  (via drill 0.6)
  Top 0.254: PROP2.22 42.57,23.3 v43.65,22.22 | v46.19,14.6 62.7,14.6 74.13,26.03 74.13,34.92 79.21,40 79.21,60.32 81.75,60.32 84.29,62.86 R19.2
  Bottom 0.254: v43.65,22.22 43.65,17.14 v46.19,14.6
LED20  (via drill 0.6)
  Top 0.254: PROP2.23 45.11,25.84 v47.46,23.49 | v77.94,60.32 79.21,61.59 R20.2
  Bottom 0.254: v47.46,23.49 47.46,15.87 48.73,14.6 62.7,14.6 74.13,26.03 74.13,34.92 79.21,40 79.21,59.05 v77.94,60.32
LED21  (via drill 0.6)
  Top 0.254: PROP2.24 46.85,26.64 47.46,26.03 47.46,24.76 v48.73,23.49 | v50,15.87 62.7,15.87 72.86,26.03 72.86,34.92 77.94,40 77.94,53.97 75.4,53.97 74.13,55.24 74.13,57.78 69.05,62.86 R21.2
  Bottom 0.254: v48.73,23.49 48.73,17.14 v50,15.87
LED22  (via drill 0.6)
  Top 0.254: PROP2.25 47.32,27.44 48.73,26.03 48.73,24.76 50,23.49 52.54,23.49 v53.81,22.22 | v77.94,55.24 v75.4,55.24 | v50,62.86 R22.2
  Bottom 0.254: v77.94,55.24 77.94,40 72.86,34.92 72.86,26.03 62.7,15.87 56.35,15.87 55.08,17.14 55.08,22.22 v53.81,22.22 | v75.4,55.24 74.13,56.51 74.13,57.78 71.59,60.32 52.54,60.32 51.27,61.59 51.27,62.86 v50,62.86
LED24
  Top 0.254: R12.1 77.94,6.98 77.94,4.44 LED24.C
LED26
  Top 0.254: R13.1 90.64,6.98 90.64,4.44 LED26.C
LED28
  Top 0.254: R14.1 91.91,14.6 94.45,14.6 LED28.C
LED35
  Top 0.254: LED36.A LED35.C
LED37
  Top 0.254: LED37.C LED38.A
LED44
  Top 0.254: LED44.C 42.38,65.4 42.38,64.13 43.65,62.86 R22.1
MAG_SENSE  (via drill 0.6)
  Top 0.254: v47.46,41.27 52.54,41.27 v61.43,50.16 62.7,51.43 MOTOR_KILL.1 MAG.3 | PROP2.41 36.97,37.13 37.3,37.46 v37.3,41.27 | v71.59,37.46 71.59,26.03 62.7,17.14 60.16,17.14 56.35,20.95 M_R1.1
  Bottom 0.254: v37.3,41.27 v47.46,41.27 | v71.59,37.46 71.59,40 v61.43,50.16
N$1
  Top 0.254: LED1.C LED2.A
N$2
  Top 0.254: LED2.C 30.95,65.4 30.95,64.13 38.57,64.13 39.84,62.86 R1.1
N$3
  Top 0.254: LED4.A LED3.C
N$4
  Top 0.254: LED4.C 18.25,65.4 18.25,64.13 19.52,62.86 R2.1
N$4_A
  Top 0.254: 18.25,52.7 C6.2 | Q4.1 22.23,50.33 22.06,50.16 20.79,51.43 20.79,52.7 18.25,52.7 | 18.25,52.7 15.71,52.7 U_R3.2
N$5
  Top 0.254: LED5.C LED6.A
N$5_A  (via drill 0.6)
  Top 0.254: IC4.2 34.53,54.2 v33.49,55.24 | v27.14,55.24 24.6,55.24 v24.6,57.78 | v18.25,57.78 C6.1
  Bottom 0.254: v33.49,55.24 v27.14,55.24 | v24.6,57.78 v18.25,57.78
N$6
  Top 0.254: R3.1 12.55,62.24 14.44,64.13 14.44,65.4 LED6.C
N$7
  Top 0.254: LED7.C LED8.A
N$7_A  (via drill 0.6)
  Top 0.254: IC4.23 31.93,44.1 v32.22,43.81 | U_R1.1 24.6,32.38 27.14,32.38 32.22,37.46 v32.22,41.27
  Bottom 0.254: v32.22,41.27 v32.22,43.81
N$8
  Top 0.254: R4.1 6.82,55.24 5.55,56.51 5.55,62.86 4.28,62.86 LED8.C
N$8_A  (via drill 0.6)
  Top 0.254: IC4.22 31.28,44.13 v30.95,43.81 | v30.95,41.27 30.95,37.46 27.14,33.65 24.6,33.65 23.33,32.38 23.33,27.3 22.06,27.3 U_R2.1
  Bottom 0.254: v30.95,41.27 v30.95,43.81
N$9
  Top 0.254: LED10.A LED9.C
N$9_A  (via drill 0.6)
  Top 0.254: ULED1.A 14.66,33.43 15.71,32.38 16.98,32.38 v18.25,31.11 | v19.52,29.84 19.52,27.3 20.79,26.03 23.33,26.03 24.6,27.3 U_R1.2
  Bottom 0.254: v18.25,31.11 v19.52,29.84
N$10
  Top 0.254: R5.1 LED10.C
N$11
  Top 0.254: LED12.A LED11.C
N$12
  Top 0.254: R6.1 6.82,6.98 4.28,6.98 LED12.C
N$13
  Top 0.254: LED14.A LED13.C
N$14
  Top 0.254: R7.1 30.95,6.98 30.95,4.44 LED14.C
N$15
  Top 0.254: LED16.A LED15.C
N$16
  Top 0.254: R8.1 18.25,8.25 14.44,4.44 LED16.C
N$17
  Top 0.254: LED17.C LED18.A
N$18
  Top 0.254: R9.1 43.65,6.98 43.65,4.44 LED18.C
N$19
  Top 0.254: LED19.C LED20.A
N$20
  Top 0.254: R10.1 18.25,6.98 18.25,4.44 LED20.C
N$21  (via drill 0.6)
  Top 0.254: T_LED.C 66.29,48.67 v62.7,45.08 | v63.97,37.46 T_R1.1
  Bottom 0.254: v62.7,45.08 62.7,38.73 v63.97,37.46
N$22
  Top 0.254: LED22.A LED21.C
N$23
  Top 0.254: R11.1 65.24,6.98 65.24,4.44 LED22.C
N$24
  Top 0.254: LED24.A LED23.C
N$25  (via drill 0.6)
  Top 0.254: ABMM2.3 75.53,43.68 75.4,43.81 75.4,41.27 72.86,41.27 70.32,38.73 57.62,38.73 56.35,37.46 56.35,32.38 v55.08,32.38 | PROP2.28 v48.73,29.84
  Bottom 0.254: v55.08,32.38 50,32.38 48.73,31.11 v48.73,29.84
N$26
  Top 0.254: ABMM2.1 72.73,49.02 72.86,48.89 71.59,48.89 70.32,47.62 70.32,40 57.62,40 55.08,37.46 55.08,33.65 52.54,31.11 46.19,31.11 45.72,30.64 PROP2.29
N$27  (via drill 0.6)
  Top 0.254: v50,42.54 50,45.08 | 50,45.08 C1.1 | 50,45.08 v50,46.35 | ESD_R2.2 60.81,36.19 v60.16,36.19 | D1.C 55.08,29.84 v57.62,32.38
  Bottom 0.254: v60.16,36.19 60.16,38.73 52.54,46.35 v50,46.35 | v50,42.54 51.27,42.54 56.35,37.46 56.35,33.65 v57.62,32.38
N$29
  Top 0.254: LED26.A LED25.C
N$31
  Top 0.254: ESD_R1.1 62.7,20.95 | 62.7,20.95 62.7,22.22 63.34,22.86 TOUCH_SENSE.7 | 62.7,20.95 CS.1
N$32  (via drill 0.6)
  Top 0.254: TOUCH_SENSE.6 62.07,22.86 v61.43,22.22 | v63.97,22.22 65.24,22.22 64.57,21.55 CS.2
  Bottom 0.254: v61.43,22.22 v63.97,22.22
N$33
  Top 0.254: LED28.A LED27.C
N$35
  Top 0.254: LED30.A LED29.C
N$36
  Top 0.254: LED30.C 94.45,27.3 91.91,27.3 R15.1
N$38
  Top 0.254: LED32.A LED31.C
N$39
  Top 0.254: R16.1 91.91,40 94.45,40 LED32.C
N$40
  Top 0.254: LED34.A LED33.C
N$41
  Top 0.254: R17.1 91.91,52.7 94.45,52.7 LED34.C
N$43
  Top 0.254: R18.1 90.64,62.86 93.18,65.4 94.45,65.4 LED36.C
N$45
  Top 0.254: LED38.C 90.64,65.4 90.64,64.13 89.37,62.86 R19.1
N$46
  Top 0.254: LED39.C LED40.A
N$47
  Top 0.254: LED40.C 79.21,65.4 R20.1
N$48
  Top 0.254: LED42.A LED41.C
N$49
  Top 0.254: LED42.C 65.24,65.4 65.24,64.13 66.51,62.86 R21.1
N$50
  Top 0.254: LED44.A LED43.C
N$51  (via drill 0.6)  (1 unrouted)
  Top 0.254: ULED2.A 10.41,35.14 10.63,34.92 15.71,34.92 18.25,32.38 19.52,32.38 v20.79,33.65 | v22.06,31.11 U_R2.2
  Bottom 0.254: v20.79,33.65 22.06,32.38 v22.06,31.11
PROP2_USBD+  (via drill 0.6)
  Top 0.254: v18.25,23.49 X2.D+ | IC4.15 26.72,44.66 25.87,43.81 25.87,36.19 v20.79,31.11
  Bottom 0.254: v18.25,23.49 20.79,23.49 v20.79,31.11
PROP2_USBD-
  Top 0.254: IC4.16 27.38,47.38 27.14,47.62 24.6,45.08 24.6,36.19 18.25,29.84 18.25,24.76 17.78,24.29 X2.D-
PROP_3_3VOUT_A
  Top 0.254: C7.1 27.14,42.54 28.02,43.42 IC4.17 28.02,47.23 29.68,48.89 32.22,48.89 33.23,49.89 IC4.4
PROP_RESN  (via drill 0.6)
  Top 0.254: PROP2.7 27.94,29.04 v27.14,29.84 | v20.79,37.46 v20.79,45.08
  Bottom 0.254: v20.79,37.46 20.79,36.19 v27.14,29.84 | v20.79,45.08 PROP2_PROG.1
PROP_RESN_JMP_A
  Top 0.254: Q4.3 23.33,53.97 22.06,55.24 22.06,57.78 PROP2_PROG.2
PROP_RX  (via drill 0.6)
  Top 0.254: PROP2.38 39.37,34.12 v39.84,33.65 | v23.33,41.27 v23.33,48.89
  Bottom 0.254: v39.84,33.65 34.76,33.65 33.49,34.92 33.49,37.46 27.14,37.46 v23.33,41.27 | v23.33,48.89 PROP2_PROG.3
PROP_RX_JMP_A
  Top 0.254: IC4.1 35.18,59.91 34.76,60.32 24.6,60.32 PROP2_PROG.4
PROP_TX  (via drill 0.6)
  Top 0.254: PROP2.37 40.17,39.67 v39.84,40
  Bottom 0.254: v39.84,40 27.14,40 25.87,41.27 PROP2_PROG.5
PROP_TX_JMP_A  (via drill 0.6)
  Top 0.254: v32.22,57.78 32.22,55.24 32.58,54.88 IC4.5
  Bottom 0.254: PROP2_PROG.6 27.14,57.78 v32.22,57.78
SENSING_ELECTRODE  (via drill 0.6)
  Top 0.254: v61.43,18.41 59.51,20.33 ESD_R1.2 57.62,20.95 55.08,23.49 D1.A 55.08,24.76 54.7,25.14 D2.C
  Bottom 0.254: v61.43,18.41 63.97,18.41 71.59,26.03 71.59,36.19 76.67,41.27 76.67,56.51 ANTENNA.2
T_SENSE  (via drill 0.6)
  Top 0.254: v57.62,47.62 MOTOR_KILL.3 | v58.89,46.35 60.16,45.08 60.16,41.27 v69.05,41.27 | PROP2.26 47.79,28.24 48.73,27.3 v58.89,27.3 | T_R1.2 v69.05,37.46 69.05,29.84 66.51,27.3 v63.97,27.3 63.34,27.93 TOUCH_SENSE.2
  Bottom 0.254: v58.89,46.35 v57.62,47.62 | v69.05,37.46 v69.05,41.27 | v58.89,27.3 v63.97,27.3